# EAGLE schematic DisclosureDrawings (EAGLE 7.1.0)
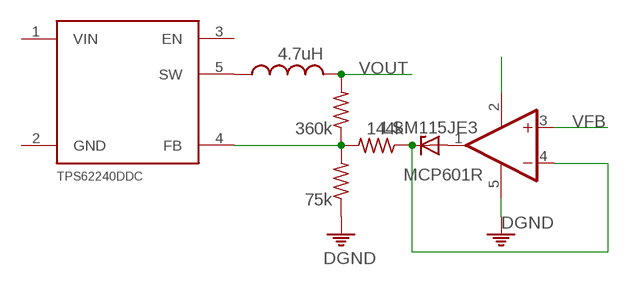
[diagram p0: schematic, sheet 1]

## Parts
D9  LSM115JE3  [DO214BA]
L19  4.7uH  LQM2HP_G0  [L1008/2520METRIC]
R105  144k  R-US_R0603  [R0603]
R107  360k  R-US_R0603  [R0603]
R108  75k  R-US_R0603  [R0603]
U25  MCP601R  [SOT23-5]
U43  TPS62240DDC  [SOT23-5]

## Nets
N$187: D9.C R105.1 U25.4(-IN)
N$188: R105.2 R107.1 R108.2 U43.4(FB)
N$189: L19.1 U43.5(SW)
N$190: D9.A U25.1(OUT)
PE: R108.1 U25.5(V-) ; supply symbol labelled DGND
V1: U25.2(V+)
VFB: U25.3(+IN)
VOUT: L19.2 R107.2
Unconnected: U43.1(VIN) U43.2(GND) U43.3(EN)

## Library data of the parts
D9 = IKE:LSM115JE3: Z DIODE
L19 = IKE:LQM2HP_G0
R105 R107 R108 = rcl:R-US_: RESISTOR, American symbol
U25 = linear:MCP601: Single Op Amp 2.7V to 6.0V Single Supply CMOS Source: http://ww1.microchip.com/downloads/en/DeviceDoc/21314g.pdf
U43 = IKE:TPS62240DDC